# EAGLE schematic ESC v0.1 (EAGLE 9.3.2)
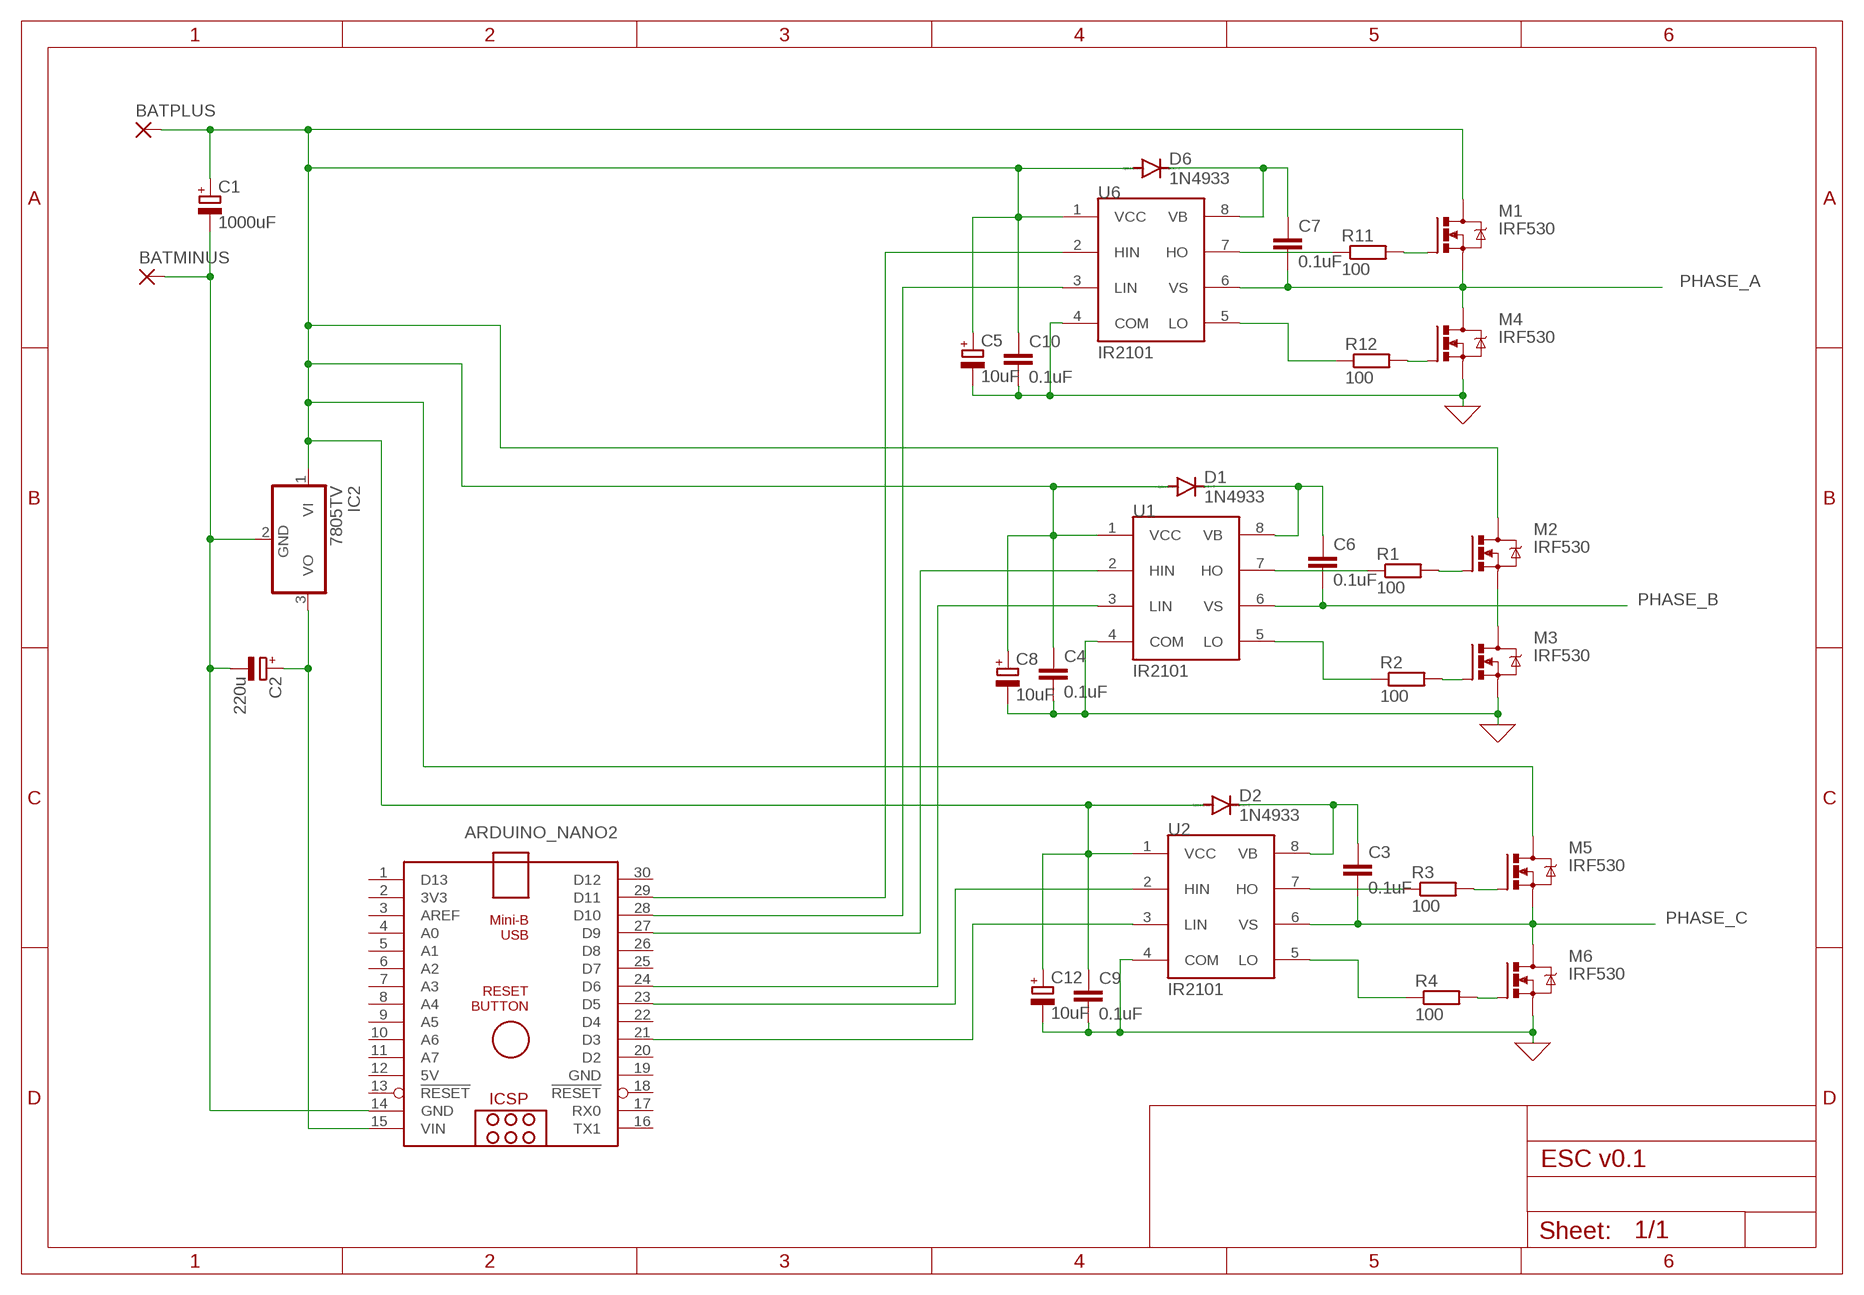
[diagram p0: schematic, sheet 1]

## Parts
ARDUINO_NANO2  ARDUINO_NANO  [ARDUINO_NANO]
BATMINUS  WIREPADSMD2,54-5,08  [SMD2,54-5,08]
BATPLUS  WIREPADSMD2,54-5,08  [SMD2,54-5,08]
C1  1000uF  CPOL-EUE5-10.5  [E5-10,5]
C2  220u  CPOL-EUE3.5-8  [E3,5-8]
C3  0.1uF  C-EU025-024X044  [C025-024X044]
C4  0.1uF  C-EU025-024X044  [C025-024X044]
C5  10uF  CPOL-EUE2-5  [E2-5]
C6  0.1uF  C-EU025-024X044  [C025-024X044]
C7  0.1uF  C-EU025-024X044  [C025-024X044]
C8  10uF  CPOL-EUE2-5  [E2-5]
C9  0.1uF  C-EU025-024X044  [C025-024X044]
C10  0.1uF  C-EU025-024X044  [C025-024X044]
C12  10uF  CPOL-EUE2-5  [E2-5]
D1  1N4933  [DO41-10]
D2  1N4933  [DO41-10]
D6  1N4933  [DO41-10]
IC2  7805TV  [TO220V]
M1  IRF530  [TO220BV]
M2  IRF530  [TO220BV]
M3  IRF530  [TO220BV]
M4  IRF530  [TO220BV]
M5  IRF530  [TO220BV]
M6  IRF530  [TO220BV]
R1  100  R-EU_R0805  [R0805]
R2  100  R-EU_R0805  [R0805]
R3  100  R-EU_R0805  [R0805]
R4  100  R-EU_R0805  [R0805]
R11  100  R-EU_R0805  [R0805]
R12  100  R-EU_R0805  [R0805]
U1  IR2101  [DIL08]
U2  IR2101  [DIL08]
U6  IR2101  [DIL08]

## Nets
COM: C4.2 C5.- C8.- C9.2 C10.2 C12.- M3.S M4.S M6.S U1.4(COM) U2.4(COM) U6.4(COM) ; supply symbol labelled GND
N$1: R1.1 U1.7(HO)
N$2: R2.1 U1.5(LO)
N$3: M3.G R2.2
N$4: M2.G R1.2
N$5: M2.S M3.D
N$6: U1.3(LIN)
N$7: U1.2(HIN)
N$8: R3.1 U2.7(HO)
N$9: R4.1 U2.5(LO)
N$10: M6.G R4.2
N$11: M5.G R3.2
N$12: M5.S M6.D
N$13: U2.3(LIN)
N$14: U2.2(HIN)
N$33: ARDUINO_NANO2.23(D5)
N$34: ARDUINO_NANO2.24(D6)
N$41: ARDUINO_NANO2.28(D10) U6.3(LIN)
N$42: ARDUINO_NANO2.27(D9)
N$44: R11.1 U6.7(HO)
N$45: R12.1 U6.5(LO)
N$46: M4.G R12.2
N$47: M1.G R11.2
N$48: M1.S M4.D
N$50: ARDUINO_NANO2.14(GND) BATMINUS.1(P) C1.- C2.- IC2.2(GND)
N$51: ARDUINO_NANO2.29(D11) U6.2(HIN)
N$53: ARDUINO_NANO2.15(VIN) C2.+ IC2.3(VO)
N$57: ARDUINO_NANO2.21(D3)
PHASE_A: C7.2 U6.6(VS)
PHASE_B: C6.2 U1.6(VS)
PHASE_C: C3.2 U2.6(VS)
VB: C3.1 C6.1 D1.C D2.C D6.C U1.8(VB) U2.8(VB) U6.8(VB)
VCC: BATPLUS.1(P) C1.+ C4.1 C5.+ C8.+ C9.1 C10.1 C12.+ D1.A D2.A D6.A IC2.1(VI) M1.D M2.D M5.D U1.1(VCC) U2.1(VCC) U6.1(VCC)
Unconnected: ARDUINO_NANO2.1(D13) ARDUINO_NANO2.2(3V3) ARDUINO_NANO2.3(AREF) ARDUINO_NANO2.4(A0) ARDUINO_NANO2.5(A1) ARDUINO_NANO2.6(A2) ARDUINO_NANO2.7(A3) ARDUINO_NANO2.8(A4) ARDUINO_NANO2.9(A5) ARDUINO_NANO2.10(A6) ARDUINO_NANO2.11(A7) ARDUINO_NANO2.13(!RESET) ARDUINO_NANO2.16(TX1) ARDUINO_NANO2.17(RX0) ARDUINO_NANO2.18(!RESET) ARDUINO_NANO2.20(D2) ARDUINO_NANO2.22(D4) ARDUINO_NANO2.25(D7) ARDUINO_NANO2.26(D8) ARDUINO_NANO2.30(D12) C7.1

## Power pins joined to a net without a drawn wire
5V: ARDUINO_NANO2.12(5V)
GND: ARDUINO_NANO2.19(GND)

## Library data of the parts
ARDUINO_NANO2 = ArduinoNanoV30:ARDUINO_NANO: Arduino Nano V3.0 Overview: The Arduino Nano is a small, complete, and breadboard-friendly board based on the ATmega328 (Arduino Nano 3.x) or ATmega168 (Arduino Nano 2.x). It has more or less the same functionality of the Arduino Duemilanove, but in a different package. It lacks only a DC power jack, and works with a Mini-B USB cable instead of a standard one. The Nano was designed and is being produced by Gravitech. Specifications: Microcontroller Atmel ATmega168 or ATmega328 Operating Voltage (logic level) 5 V Input Voltage (recommended) 7-12 V Input Voltage (limits) 6-20 V Digital I/O Pins 14 (of which 6 provide PWM output) Analog Input Pins 8 DC Current per I/O Pin 40 mA Flash Memory 16 KB (ATmega168) or 32 KB (ATmega328) of which 2 KB used by bootloader SRAM 1 KB (ATmega168) or 2 KB (ATmega328) EEPROM 512 bytes (ATmega168) or 1 KB (ATmega328) Clock Speed 16 MHz Dimensions 0.73" x 1.70" Length 45 mm Width 18 mm Weigth 5 g Power: The Arduino Nano can be powered via the Mini-B USB connection, 6-20V unregulated external power supply (pin 30), or 5V regulated external power supply (pin 27). The power source is automatically selected to the highest voltage source. Memory: The ATmega168 has 16 KB of flash memory for storing code (of which 2 KB is used for the bootloader); the ATmega328 has 32 KB, (also with 2 KB used for the bootloader). The ATmega168 has 1 KB of SRAM and 512 bytes of EEPROM (which can be read and written with the EEPROM library); the ATmega328 has 2 KB of SRAM and 1 KB of EEPROM. Input and Output: Each of the 14 digital pins on the Nano can be used as an input or output, using pinMode(), digitalWrite(), and digitalRead() functions. They operate at 5 volts. Each pin can provide or receive a maximum of 40 mA and has an internal pull-up resistor (disconnected by default) of 20-50 kOhms. In addition, some pins have specialized functions. Visit Arduino - ArduinoBoardNano <https://www.arduino.cc/en/Main/ArduinoBoardNano>
BATMINUS BATPLUS = wirepad:WIREPAD: Wire PAD connect wire on PCB
C1 C2 C5 C8 C12 = rcl:CPOL-EU: POLARIZED CAPACITOR, European symbol; SPICEPREFIX: C
C3 C4 C6 C7 C9 C10 = rcl:C-EU: CAPACITOR, European symbol; SPICEPREFIX: C
D1 D2 D6 = diode:1N4933: DIODE fast recovery rectifier, 1A
IC2 = linear:78*: Positive VOLTAGE REGULATOR Source: http://cache.national.com/ds/LM/LM78L05.pdf http://www.fairchildsemi.com/ds/LM/LM7805.pdf
M1-M6 = transistor-power:IRF530: HEXFET Power MOSFET
R1-R4 R11 R12 = rcl:R-EU_: RESISTOR, European symbol; SPICEPREFIX: R
U1 U2 U6 = IR2101:IR2101: High and low side driver; AVAILABILITY: Unavailable; DESCRIPTION: High and Low Side Driver, Noninverting Inputs; MF: Infineon; MP: IR2101; PACKAGE: DIP-8 International Rectifier; PRICE: None